# Altium schematic sheet Main.SchDoc
size A4
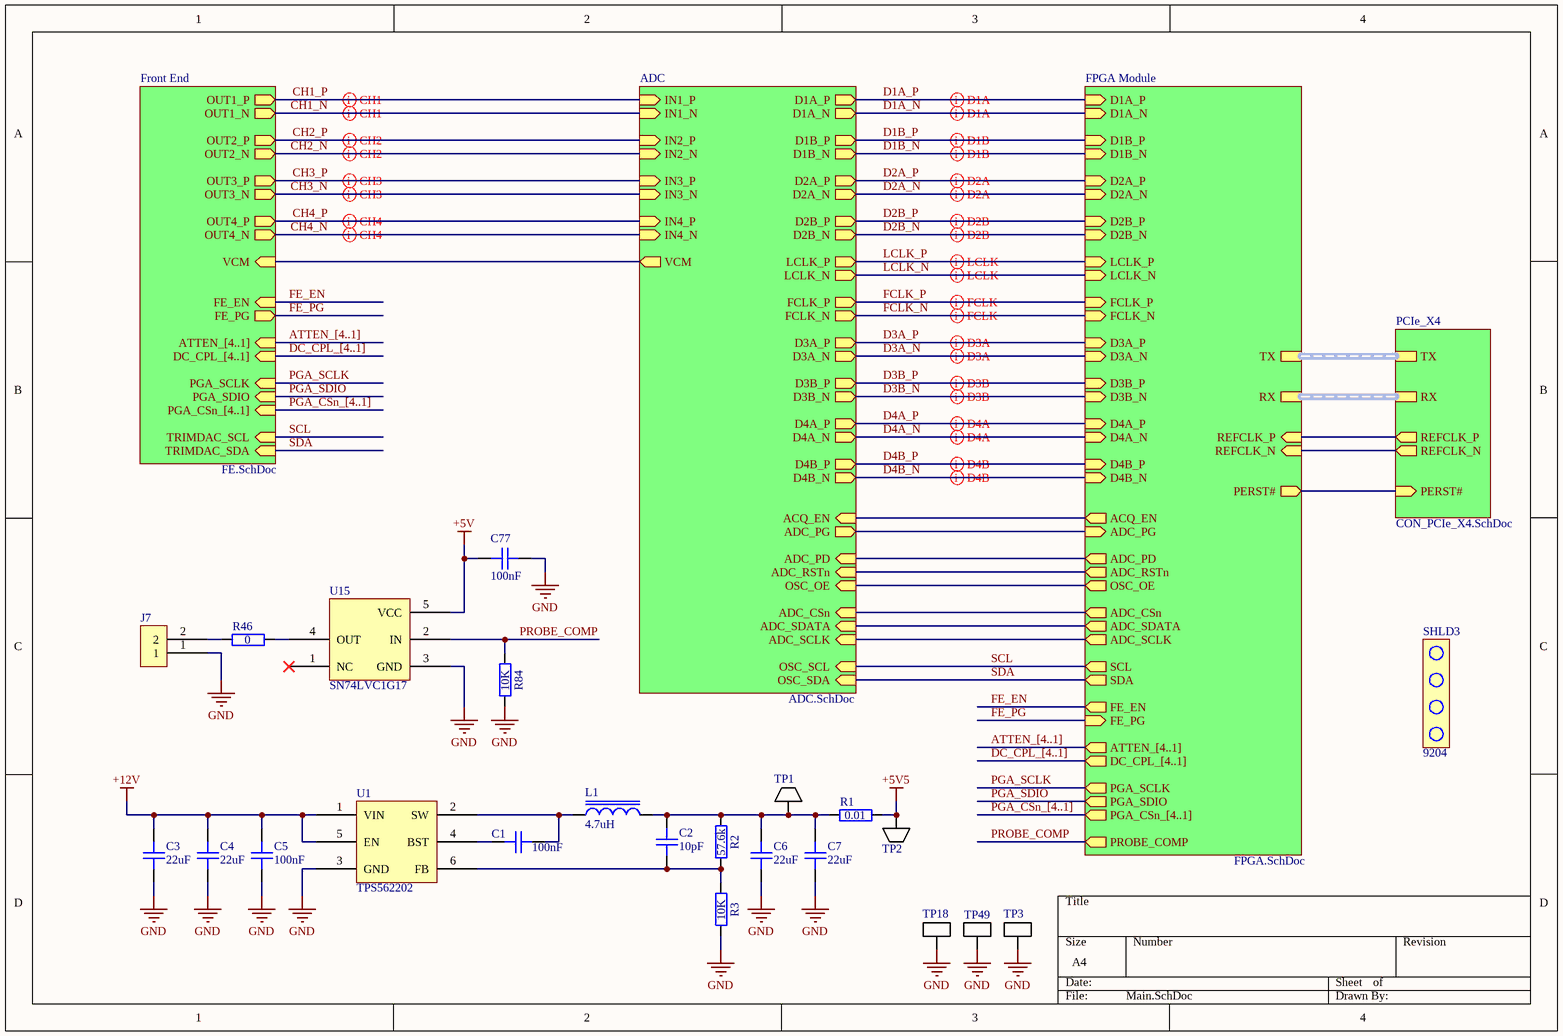
[diagram p0: Main.SchDoc]

## Parts
C1  100nF  [GEN_C_0402]
C2  10pF  [GEN_C_0402]
C3  22uF  [GEN_C_0805]
C4  22uF  [GEN_C_0805]
C5  100nF  [GEN_C_0402]
C6  22uF  [GEN_C_0805]
C7  22uF  [GEN_C_0805]
C77  100nF  [GEN_C_0402]
J7  TSW-101-08-F-D-RA  [GEN_2.54mm_1x2_Pin_TH_RA]  (value not drawn)
L1  4.7uH  [TY_IND_NRS5030]
R1  0.01  [GEN_R_0603]
R2  57.6k  [GEN_R_0402]
R3  10K  [GEN_R_0402]
R46  0  [GEN_R_0402]
R84  10K  [GEN_R_0402]
SHLD3  9204
TP1  5015  [KEY_5015]  (value not drawn)
TP2  5015  [KEY_5015]  (value not drawn)
TP3  5019  [KEY_5019]  (value not drawn)
TP18  5019  [KEY_5019]  (value not drawn)
TP49  5019  [KEY_5019]  (value not drawn)
U1  TPS562202  [TI_SOT563_DRL0006A]
U15  SN74LVC1G17  [GEN_SC-70-5]

## Sub-sheets
ADC = ADC.SchDoc: IN4_N (in), IN4_P (in), IN3_N (in), IN3_P (in), IN2_N (in), IN2_P (in), VCM (out), IN1_N (in), IN1_P (in), ADC_CSn (in), ADC_SDATA (in), ADC_SCLK (in), ADC_RSTn (in), ADC_PD (in), D1A_N (out), D1A_P (out), D1B_P (out), D1B_N (out), D2A_P (out), D2A_N (out), D2B_N (out), D2B_P (out), LCLK_P (out), LCLK_N (out), FCLK_N (out), FCLK_P (out), D3A_P (out), D3A_N (out), D3B_P (out), D3B_N (out), D4A_P (out), D4A_N (out), D4B_P (out), D4B_N (out), ACQ_EN (in), ADC_PG (out), OSC_OE (in), OSC_SDA (in), OSC_SCL (in)
FPGA Module = FPGA.SchDoc: PERST# (out), REFCLK_N (in), REFCLK_P (in), D1A_P (in), D1A_N (in), D1B_P (in), D1B_N (in), D2A_P (in), D2A_N (in), D2B_P (in), D2B_N (in), LCLK_P (in), LCLK_N (in), FCLK_P (in), FCLK_N (in), D3A_P (in), D3A_N (in), D3B_P (in), D3B_N (in), D4A_P (in), D4A_N (in), D4B_P (in), D4B_N (in), ACQ_EN (out), ADC_PG (in), ADC_PD (out), ADC_RSTn (out), OSC_OE (out), ADC_CSn (out), ADC_SDATA (out), ADC_SCLK (out), SCL (out), SDA (out), FE_EN (out), FE_PG (in), ATTEN_[4..1] (out), DC_CPL_[4..1] (out), PGA_SCLK (out), PGA_SDIO (out), PGA_CSn_[4..1] (out), RX (harness PCIe_X4_RX), TX (harness PCIe_X4_TX), PROBE_COMP (out)
Front End = FE.SchDoc: OUT1_P (out), OUT1_N (out), OUT3_P (out), OUT3_N (out), OUT4_N (out), OUT2_N (out), OUT2_P (out), OUT4_P (out), VCM (in), DC_CPL_[4..1] (in), ATTEN_[4..1] (in), PGA_SCLK (in), PGA_CSn_[4..1] (in), PGA_SDIO (in), TRIMDAC_SCL (in), TRIMDAC_SDA (in), FE_EN (in), FE_PG (out)
PCIe_X4 = CON_PCIe_X4.SchDoc: REFCLK_N (out), PERST# (in), REFCLK_P (out), TX (harness PCIe_X4_TX), RX (harness PCIe_X4_RX)

## Nets
+5V: C77.1 U15.5(VCC)
+5V5: R1.2 TP2.1
+12V: C3.2 C4.2 C5.1 U1.1(VIN) U1.5(EN)
GND: C3.1 C4.1 C5.2 C6.1 C7.1 C77.2 J7.1 R3.1 R84.1 TP3.1 TP18.1 TP49.1 U1.3(GND) U15.3(GND)
CH1_N: sheet Front End/OUT1_N, sheet ADC/IN1_N
CH1_P: sheet Front End/OUT1_P, sheet ADC/IN1_P
CH2_N: sheet Front End/OUT2_N, sheet ADC/IN2_N
CH2_P: sheet Front End/OUT2_P, sheet ADC/IN2_P
CH3_N: sheet Front End/OUT3_N, sheet ADC/IN3_N
CH3_P: sheet Front End/OUT3_P, sheet ADC/IN3_P
CH4_N: sheet Front End/OUT4_N, sheet ADC/IN4_N
CH4_P: sheet Front End/OUT4_P, sheet ADC/IN4_P
D1A_N: sheet ADC/D1A_N, sheet FPGA Module/D1A_N
D1A_P: sheet ADC/D1A_P, sheet FPGA Module/D1A_P
D1B_N: sheet ADC/D1B_N, sheet FPGA Module/D1B_N
D1B_P: sheet ADC/D1B_P, sheet FPGA Module/D1B_P
D2A_N: sheet ADC/D2A_N, sheet FPGA Module/D2A_N
D2A_P: sheet ADC/D2A_P, sheet FPGA Module/D2A_P
D2B_N: sheet ADC/D2B_N, sheet FPGA Module/D2B_N
D2B_P: sheet ADC/D2B_P, sheet FPGA Module/D2B_P
D3A_N: sheet ADC/D3A_N, sheet FPGA Module/D3A_N
D3A_P: sheet ADC/D3A_P, sheet FPGA Module/D3A_P
D3B_N: sheet ADC/D3B_N, sheet FPGA Module/D3B_N
D3B_P: sheet ADC/D3B_P, sheet FPGA Module/D3B_P
D4A_N: sheet ADC/D4A_N, sheet FPGA Module/D4A_N
D4A_P: sheet ADC/D4A_P, sheet FPGA Module/D4A_P
D4B_N: sheet ADC/D4B_N, sheet FPGA Module/D4B_N
D4B_P: sheet ADC/D4B_P, sheet FPGA Module/D4B_P
FCLK_N: sheet ADC/FCLK_N, sheet FPGA Module/FCLK_N
FCLK_P: sheet ADC/FCLK_P, sheet FPGA Module/FCLK_P
FE_EN: sheet Front End/FE_EN, sheet FPGA Module/FE_EN
FE_PG: sheet Front End/FE_PG, sheet FPGA Module/FE_PG
LCLK_N: sheet ADC/LCLK_N, sheet FPGA Module/LCLK_N
LCLK_P: sheet ADC/LCLK_P, sheet FPGA Module/LCLK_P
PGA_SCLK: sheet Front End/PGA_SCLK, sheet FPGA Module/PGA_SCLK
PGA_SDIO: sheet Front End/PGA_SDIO, sheet FPGA Module/PGA_SDIO
PROBE_COMP: R84.2 U15.2(IN) ; sheet FPGA Module/PROBE_COMP
SCL: sheet Front End/TRIMDAC_SCL, sheet ADC/OSC_SCL, sheet FPGA Module/SCL
SDA: sheet Front End/TRIMDAC_SDA, sheet ADC/OSC_SDA, sheet FPGA Module/SDA
NetC1_1: C1.1 L1.1 U1.2(SW)
NetC1_2: C1.2 U1.4(BST)
NetC2_1: C2.1 R2.1 R3.2 U1.6(FB)
NetC2_2: C2.2 C6.2 C7.2 L1.2 R1.1 R2.2 TP1.1
NetJ7_2: J7.2 R46.1
NetR46_2: R46.2 U15.4(OUT)
(unnamed): sheet Front End/VCM, sheet ADC/VCM
(unnamed): sheet ADC/ADC_CSn, sheet FPGA Module/ADC_CSn
(unnamed): sheet ADC/ADC_SDATA, sheet FPGA Module/ADC_SDATA
(unnamed): sheet ADC/ADC_SCLK, sheet FPGA Module/ADC_SCLK
(unnamed): sheet ADC/ADC_RSTn, sheet FPGA Module/ADC_RSTn
(unnamed): sheet ADC/ADC_PD, sheet FPGA Module/ADC_PD
(unnamed): sheet ADC/ACQ_EN, sheet FPGA Module/ACQ_EN
(unnamed): sheet ADC/ADC_PG, sheet FPGA Module/ADC_PG
(unnamed): sheet ADC/OSC_OE, sheet FPGA Module/OSC_OE
(unnamed): sheet FPGA Module/PERST#, sheet PCIe_X4/PERST#
(unnamed): sheet FPGA Module/REFCLK_N, sheet PCIe_X4/REFCLK_N
(unnamed): sheet FPGA Module/REFCLK_P, sheet PCIe_X4/REFCLK_P

Not connected (* = marked no-connect by the designer): U15 1(NC)*

## Buses and harness runs
bus ATTEN_[4..1] = sheet FPGA Module/ATTEN_[4..1]
bus ATTEN_[4..1] = sheet Front End/ATTEN_[4..1]
bus DC_CPL_[4..1] = sheet FPGA Module/DC_CPL_[4..1]
bus DC_CPL_[4..1] = sheet Front End/DC_CPL_[4..1]
bus PGA_CSn_[4..1] = sheet FPGA Module/PGA_CSn_[4..1]
bus PGA_CSn_[4..1] = sheet Front End/PGA_CSn_[4..1]
harness sheet FPGA Module/RX = sheet PCIe_X4/RX
harness sheet FPGA Module/TX = sheet PCIe_X4/TX

## Layout directives
differential pair: CH1_N, CH1_P, CH2_N, CH2_P, CH3_N, CH3_P, CH4_N, CH4_P, D1A_N, D1A_P, D1B_N, D1B_P, D2A_N, D2A_P, D2B_N, D2B_P, D3A_N, D3A_P, D3B_N, D3B_P, D4A_N, D4A_P, D4B_N, D4B_P, FCLK_N, FCLK_P, LCLK_N, LCLK_P

## Library data of the parts
C1 C5 C77 = CAP 100nF 16V X7R 0402: Voltage Rating: 16V; Package: 0402; Supplier 1: Digi-Key; Supplier Part Number 1: 490-4759-1-ND; Value: 100nF
C2 = CAP 10pF 50V C0G 0402: Temperature Coefficient: C0G; Voltage Rating: 50V; Package: 0402; Value: 10pF; Supplier 1: Digi-Key; Supplier Part Number 1: 1276-1139-1-ND
C3 C4 C6 C7 = CAP 22uF 25V X5R 0805: Voltage Rating: 25V; Package: 0805; Value: 22uF; Supplier 1: Digi-Key; Supplier Part Number 1: 490-10749-1-ND
J7 = CONN 2.54mm 2 Pin TH RA: Supplier 1: Digi-Key; Supplier Part Number 1: SAM12296-ND
L1 = IND 4.7uH 2.6A 35 MOHM SMD: Value: 4.7uH; Supplier 1: Digi-Key; Supplier Part Number 1: 587-3461-1-ND
R1 = RES 0.01 OHM 1% 1/4W 0603: Tolerance: 1%; Power Rating: 0.25W; Supplier 1: Digi-Key; Supplier Part Number 1: 408-1404-1-ND; Value: 0.01; Package: 0603
R2 = RES 57.6K OHM 1% 1/16W 0402: Tolerance: 1%; Power Rating: 0.0625W; Package: 0402; Value: 57.6k; Supplier 1: Digi-Key; Supplier Part Number 1: YAG3190CT-ND
R3 R84 = RES 10K OHM 1% 1/10W 0402: Tolerance: 1%; Power Rating: 0.1W; Package: 0402; Supplier 1: Digi-Key; Supplier Part Number 1: P10.0KLCT-ND; Value: 10K
R46 = RES 0 OHM 1/16W 0402: Power Rating: 0.0625W; Package: 0402; Supplier 1: Digi-Key; Supplier Part Number 1: 311-0.0JRCT-ND; Value: 0
SHLD3 = PCIe IO Shield: Supplier 1: Mouser; Supplier Part Number 1: 534-9204
TP1 TP2 = TP KEYSTONE 5015: Supplier 1: Digi-Key; Supplier Part Number 1: 36-5015CT-ND
TP3 TP18 TP49 = TP KEYSTONE 5019: Supplier 1: Digi-Key; Supplier Part Number 1: 36-5019CT-ND
U1 = IC BUCK TPS562202: Supplier 1: Digi-Key; Supplier Part Number 1: 296-TPS562202DRLRCT-ND
U15 = IC BUFFER SN74LVC1G17: Supplier 1: Digi-Key; Supplier Part Number 1: 296-11934-1-ND